# Altium project USV_drive_PCB_Project.PrjPcb
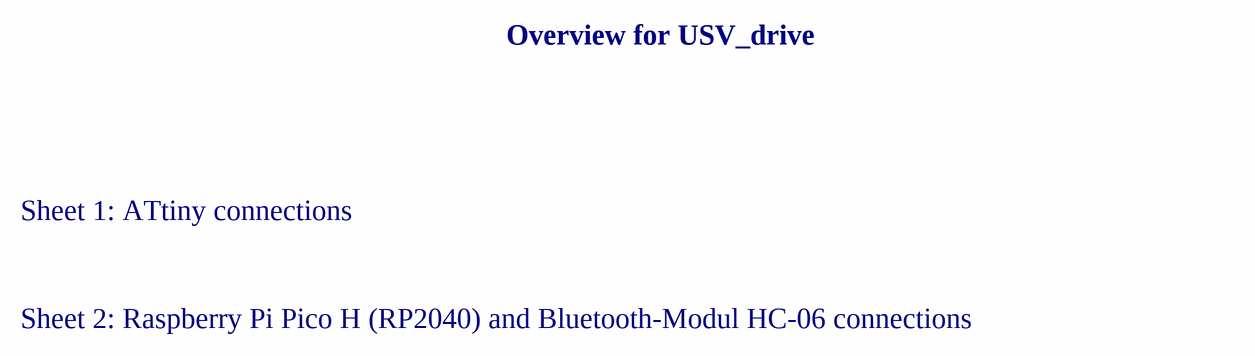
[diagram p0: Overview.SchDoc]
3 sheets, 43 parts. Net scope: flat (ports and power ports of the same name join across sheets).
Board file: USV_drive_PCB.PcbDoc
Sheets:
  Overview.SchDoc
  ATtiny_Connections.SchDoc
  Connectors.SchDoc

## Sheet Overview.SchDoc: Overview_USV_drive
size A4; Organization: Ernst-Abbe-Hochschule Jena; Address1: FB Maschinenbau; Address2: Carl-Zeiss-Promenade 2; Address3: 07745 Jena; Address4: Germany; DocumentNumber: 1; SheetNumber: 1; SheetTotal: 3

### Notes on the sheet
- Overview for USV_drive
- Sheet 1: ATtiny connections
- Sheet 2: Raspberry Pi Pico H (RP2040) and Bluetooth-Modul HC-06 connections
- Title
- Size:
- Date:
- A4
- Number:
- Time:
- Revision:
- Sheet
- of
- File:

## Sheet ATtiny_Connections.SchDoc: ATiny_connections
size A4; Organization: Ernst-Abbe-Hochschule Jena; Address1: FB Maschinenbau; Address2: Carl-Zeiss-Promenade 2; Address3: 07745 Jena; Address4: Germany; DocumentNumber: 2; SheetNumber: 2; SheetTotal: 3; SPICEModelCacheYXNNQHYV: <root> / <DocumentId>YXNNQHYV</DocumentId> / </root>
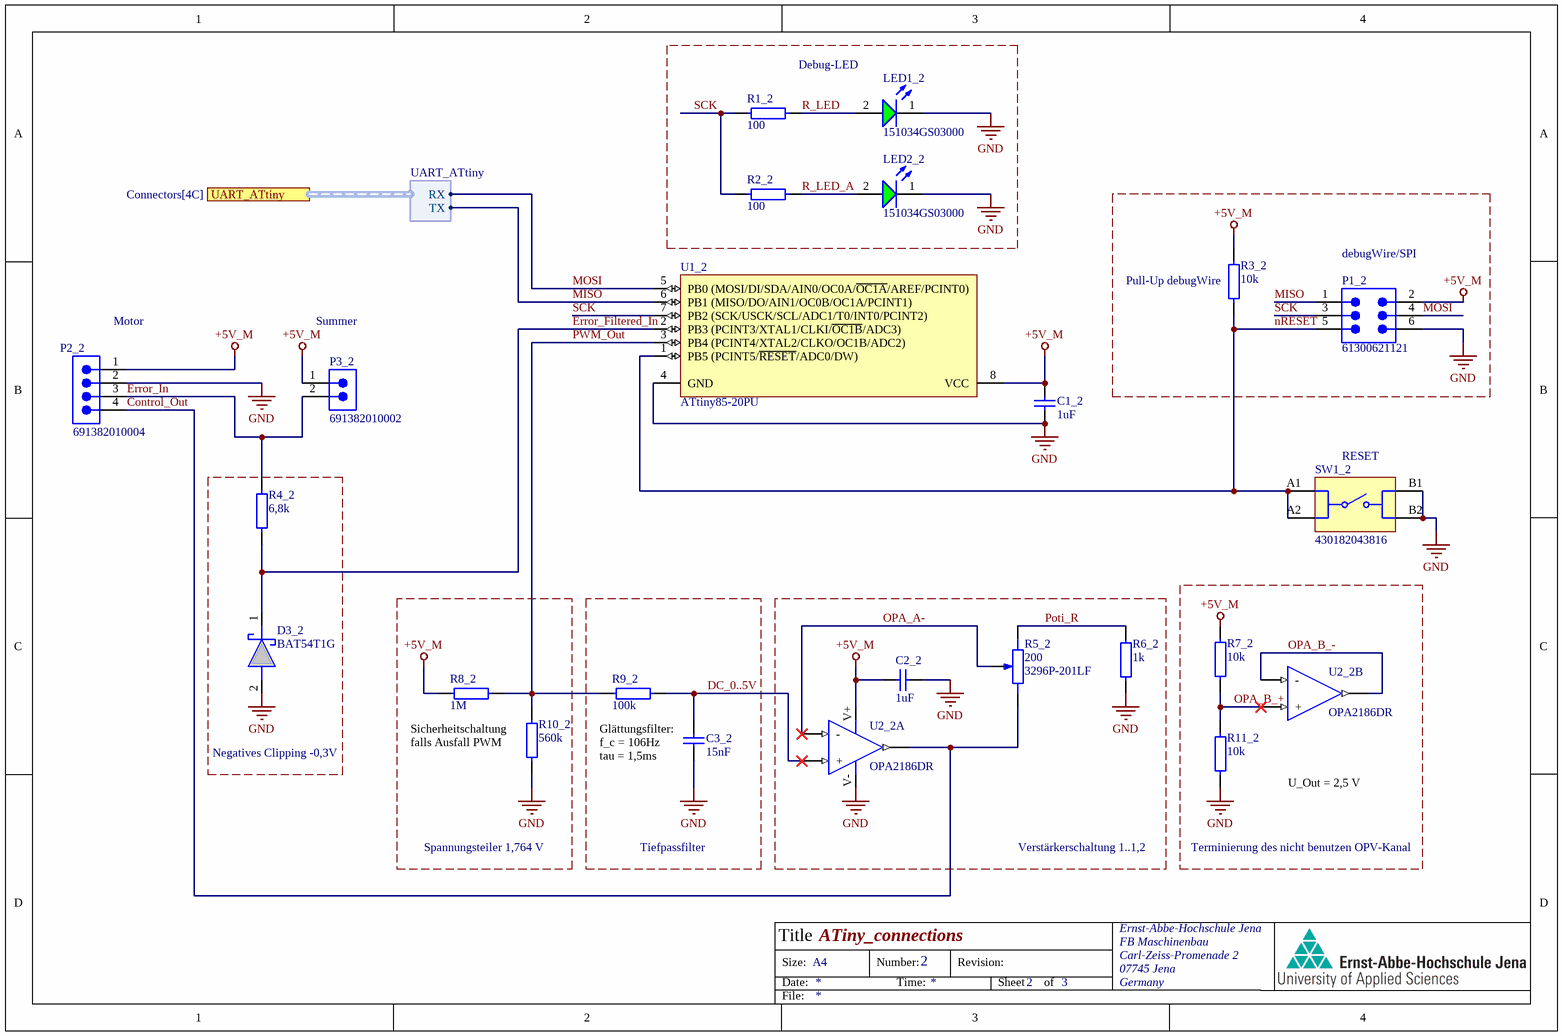
[diagram p1: ATtiny_Connections.SchDoc]

### Parts
C1_2  1uF  [SMD-0805]
C2_2  1uF  [SMD-0805]
C3_2  15nF  [SMD-0805]
D3_2  BAT54T1G  [SOD3716X135N]
LED1_2  Green, 3.2V, 30°  [WL-TMRW_D3.9H5.3]  (value not drawn)
LED2_2  Green, 3.2V, 30°  [WL-TMRW_D3.9H5.3]  (value not drawn)
P1_2  61300621121  [61300621121]
P2_2  691382010004  [691382010004]
P3_2  691382010002  [691382010002]
R1_2  100  [R-SMD-0805]
R2_2  100  [R-SMD-0805]
R3_2  10k  [R-SMD-0805]
R4_2  6,8k  [R-SMD-0805]
R5_2  200  Manufacturer Part Nr.: 3296P-201LF  [3296P-1-201LF]
R6_2  1k  [R-SMD-0805]
R7_2  10k  [R-SMD-0805]
R8_2  1M  [R-SMD-0805]
R9_2  100k  [R-SMD-0805]
R10_2  560k  [R-SMD-0805]
R11_2  10k  [R-SMD-0805]
SW1_2  430182043816  [430182043816]
U1_2  ATtiny85-20PU  [8P3]
U2_2  OPA2186DR  [SOIC127P600-8BM]  (parts A,B of 2)

### Blocks framed on the sheet
Debug-LED: LED1_2 LED2_2 R1_2 R2_2
Negatives Clipping -0,3V: D3_2 R4_2
Spannungsteiler 1,764 V: R8_2 R10_2
Tiefpassfilter: C3_2 R9_2
Verstärkerschaltung 1..1,2: C2_2 R5_2 R6_2 U2_2
Terminierung des nicht benutzen OPV-Kanal: R7_2 R11_2 U2_2

### Ports
UART_ATtiny (harness UART_ATtiny, see Connectors[4C])

### Harnesses
UART_ATtiny: RX, TX

### Nets
+5V_M: C1_2.2 C2_2.2 P1_2.2 P2_2.1 P3_2.1 R3_2.2 R7_2.2 R8_2.1 U1_2.8(VCC) U2_2.V+
GND: C1_2.1 C2_2.1 C3_2.1 D3_2.2(A) LED1_2.1(K) LED2_2.1(K) P1_2.6 P2_2.2 R6_2.2 R10_2.1 R11_2.1 SW1_2.B1 SW1_2.B2 U1_2.4(GND) U2_2.V-
Control_Out: P2_2.4 R5_2.1 U2_2.OUTA(OUT)
DC_0..5V: C3_2.2 R9_2.2 U2_2.IPA(+)
Error_Filtered_In: D3_2.1(K) R4_2.1 U1_2.2(PB3_(PCINT3/XTAL1/CLKI/~{OC1B}/ADC3))
Error_In: P2_2.3 P3_2.2 R4_2.2
MISO: P1_2.1 U1_2.6(PB1_(MISO/DO/AIN1/OC0B/OC1A/PCINT1)) ; port UART_ATtiny.TX
MOSI: P1_2.4 U1_2.5(PB0_(MOSI/DI/SDA/AIN0/OC0A/~{OC1A}/AREF/PCINT0)) ; port UART_ATtiny.RX
nRESET: P1_2.5 R3_2.1 SW1_2.A1 SW1_2.A2 U1_2.1(PB5_(PCINT5/~{RESET}/ADC0/DW))
OPA_A-: R5_2.2(TAP) U2_2.INA(-)
OPA_B_+: R7_2.1 R11_2.2 U2_2.IPB(+)
OPA_B_-: U2_2.INB(-) U2_2.OUTB(OUT)
Poti_R: R5_2.3 R6_2.1
PWM_Out: R8_2.2 R9_2.1 R10_2.2 U1_2.3(PB4_(PCINT4/XTAL2/CLKO/OC1B/ADC2))
R_LED: LED1_2.2(A) R1_2.2
R_LED_A: LED2_2.2(A) R2_2.2
SCK: P1_2.3 R1_2.1 R2_2.1 U1_2.7(PB2_(SCK/USCK/SCL/ADC1/T0/INT0/PCINT2))

### Notes on the sheet
- (near R3_2) Pull-Up debugWire
- (near P1_2) debugWire/SPI
- (near P2_2) Motor
- Summer
- (near SW1_2) RESET
- (near R10_2) Sicherheitschaltung falls Ausfall PWM
- (near C3_2) Glättungsfilter:
  f_c = 106Hz
  tau = 1,5ms
- U_Out = 2,5 V
- Title
- Size:
- Date:
- A4
- Number:
- Time:
- Revision:
- Sheet
- of
- File:

### Library data of the parts
C1_2 C2_2 C3_2 = C: Kondensator
  C1_2 C2_2: Value: 1uF
  C3_2: Value: 15nF
D3_2 = BAT54T1G: S Prefix for Automotive and Other Applications Requiring Unique Site and Control Change Requirements; AEC-Q101 Qualified and PPAP Capable; Low Forward Voltage 350 mV (Typ) @ IF = 10 mA; Extremely Fast Switching Speed; These Devices are Pb-Free, Halogen Free/BFR Free and are RoHS Compliant; Manufacturer_Name: onsemi; Geometry.Height: 1.35mm; Manufacturer_Part_Number: BAT54T1G; Mouser Part Number: 863-BAT54T1G; Mouser Price/Stock: https://www.mouser.co.uk/ProductDetail/onsemi/BAT54T1G?qs=vLkC5FC1VN9XK%252B%252BtdP3lYw%3D%3D; Arrow Part Number: BAT54T1G; Arrow Price/Stock: https://www.arrow.com/en/products/bat54t1g/on-semiconductor?utm_currency=USD&region=nac; Datasheet Link: https://www.onsemi.com/pub/Collateral/BAT54T1-D.PDF
LED1_2 LED2_2 = 151034GS03000: WL-TMRW Mono-color Round Waterclear, THT, D3.9 x H5.3mm, Green, 3.2V, 30°; Manufacturer: Wurth Elektronik; Chip Technology: InGaN; Dominant Wavelength: 530nm; Luminous Intensity: 10000mcd; Peak Wavelength: 525nm; Manufacturer Part Number: 151034GS03000; Category: Signal LEDs; Match Code: WL-TMRW; ComponentLink1Description: Website Link; ComponentLink1URL: https://www.we-online.com/redexpert/article/151034GS03000?ad; ComponentLink2Description: Datasheet Link; ComponentLink2URL: https://www.we-online.com/redexpert/spec/151034GS03000?ad; Mount: Through Hole; Operating Temperature Max: 85°C; Operating Temperature Min: -40°C; Packaging: Bulk; Height: 5.3mm; Diameter: 3.9mm; Emitting Color: Green; Forward Voltage: 3.2V; Viewing Angle: 30°
P1_2 = 61300621121: WR-PHD Pin Header, THT, Vertical, pitch 2.54mm, 2 Row, 6P; Manufacturer: Wurth Elektronik; Contact Resistance: 20mOhm; Rated Current: 3A; Working Voltage: 250V; Withstanding Voltage: 500V; Manufacturer Part Number: 61300621121; Category: Board-to-Board Connectors; Match Code: WR-PHD; ComponentLink1Description: Website Link; ComponentLink1URL: https://www.we-online.com/redexpert/article/61300621121?ad; ComponentLink2Description: Datasheet Link; ComponentLink2URL: https://www.we-online.com/redexpert/spec/61300621121?ad; Mount: Through Hole; Operating Temperature Max: 105°C; Operating Temperature Min: -40°C; Packaging: Bag; Gender: Pin Header; Number of Pins: 6; Number of Rows: 2; Orientation: Vertical; Pitch: 2.54mm
P2_2 = 691382010004: WR-TBL Series 382 Horizontal PCB Header, THT, pitch 2.5mm, 04p; Manufacturer: Wurth Elektronik; Modularity: No; Rated Current: 12A; System: Pluggable Connector; Working Voltage: 300V; Manufacturer Part Number: 691382010004; Category: Terminal Block; Match Code: WR-TBL; ComponentLink1Description: Website Link; ComponentLink1URL: https://www.we-online.com/redexpert/article/691382010004?ad; ComponentLink2Description: Datasheet Link; ComponentLink2URL: https://www.we-online.com/redexpert/spec/691382010004?ad; Mount: Through Hole; Min Operating Temperature: -40°C; Max Operating Temperature: 105°C; Packaging: Box; Application: Pluggable; Number of Pins: 4; Number of Rows: 1; Orientation: Horizontal; Pitch: 2.5mm
P3_2 = 691382010002: WR-TBL Series 382 Horizontal PCB Header, THT, pitch 2.5mm, 02p; Manufacturer: Wurth Elektronik; Modularity: No; Rated Current: 12A; System: Pluggable Connector; Working Voltage: 300V; Manufacturer Part Number: 691382010002; Category: Terminal Block; Match Code: WR-TBL; ComponentLink1Description: Website Link; ComponentLink1URL: https://www.we-online.com/redexpert/article/691382010002?ad; ComponentLink2Description: Datasheet Link; ComponentLink2URL: https://www.we-online.com/redexpert/spec/691382010002?ad; Mount: Through Hole; Min Operating Temperature: -40°C; Max Operating Temperature: 105°C; Packaging: Box; Application: Pluggable; Number of Pins: 2; Number of Rows: 1; Orientation: Horizontal; Pitch: 2.5mm
R1_2 R2_2 R3_2 R4_2 R6_2 R7_2 R8_2 R9_2 R10_2 R11_2 = R: Widerstand
  R1_2 R2_2: Value: 100
  R3_2 R7_2 R11_2: Value: 10k
  R4_2: Value: 6,8k
  R6_2: Value: 1k
  R8_2: Value: 1M
  R9_2: Value: 100k
  R10_2: Value: 560k
R5_2 = 3296P-1-201LF: Trimmer Potentiometers / Lead Sealed Type Multiturn Trimming Potentiometer / Resistance range: 200 Ohm / 25 Turns; PartNumber: PV36P???C01B00; Resistance Code: ***; Hinweis!: PartNumber muss beim Plazieren auf den Wiederstandswert laut Datenblatt abgeändert werden.; Turns: 25; Tol: +-10%; ComponentLink1Description: Datasheet; ComponentLink1URL: https://www.bourns.com/docs/Product-Datasheets/3296.pdf; Supplier 1: DigiKey; Supplier 2: Mouser; Supplier Part Number 2: 652-3296P-1-201LF; Supplier Part Number 1: 3296P-201LF-ND; Value: 200
SW1_2 = 430182043816: WS-TASV SMT Tact Switch, 6mm x 6mm, 160gf, SPST-NO, 12V, 50mA; Manufacturer: Wurth Elektronik; Washable: No; Manufacturer Part Number: 430182043816; Category: Tact Switch; Match Code: WS-TASV; ComponentLink1Description: Website Link; ComponentLink1URL: https://www.we-online.com/redexpert/article/430182043816?ad; ComponentLink2Description: Datasheet Link; ComponentLink2URL: https://www.we-online.com/redexpert/spec/430182043816?ad; Mount: Surface Mount; Min Operating Temperature: -40°C; Max Operating Temperature: 85°C; Packaging: Tape and Reel; Length: 6mm; Width: 6mm; Height: 4.3mm; Circuit: SPST-NO; Contact Material: Stainless Steel; Contact Plating: Silver; Operation Force: 160gf; Rated Current: 50mA; Rated Voltage (DC): 12V; Terminal Material: Copper Alloy; Terminal Plating: Silver
U1_2 = ATtiny85-20PU: 8-bit AVR Microcontroller, 20MHz, 2.7-5.5V, 8K Flash, 512 Bytes EEPROM, 512 Bytes SRAM, Industrial Grade (-40°C to 85°C), 8-Lead PDIP, Pb-Free; DatasheetVersion: revN, Apr-2011; PackageVersion: revB, Jan-2002; PackageReference: 8P3; PackageDescription: 8-Lead, 0.300" Wide Body, Plastic Dual In-Line Package (PDIP); Code_JEDEC: MS-001-BA; ComponentLink1Description: Manufacturer URL; ComponentLink1URL: http://www.atmel.com/; ComponentLink2Description: ATtiny25/45/85 Datasheet; ComponentLink2URL: http://www.atmel.com/dyn/resources/prod_documents/doc2586.pdf; ComponentLink3Description: ATtiny25/45/85 Summary; ComponentLink3URL: http://www.atmel.com/dyn/resources/prod_documents/2586S.pdf
U2_2 = OPA2186: The OPA186, OPA2186, and OPA4186 (OPAx186) / are low-power, 24-V, rail-to-rail input and output, zerodrift operational amplifiers (op amps). These op amps / feature only 10 µV of offset voltage (maximum) and / 0.04 µV/°C of offset voltage drift over temperature / (maximum).; pin to pad: INA>2 INB>6 IPA>3 IPB>5 OUTA>1 OUTB>7 V+>8 V->4; V+_Max: +12V; V-_Min: -12V; PartNumber: OPA2186DR; ComponentLink1Description: DataSheet; ComponentLink1URL: https://www.ti.com/lit/gpn/opa2186; Supplier 1: Digikey; Supplier 2: Mouser; Supplier Part Number 1: 296-OPA2186DRCT-ND; Supplier Part Number 2: 595-OPA2186DR

## Sheet Connectors.SchDoc: RP2040 Pico and HC-06 connections
size A4; Organization: Ernst-Abbe-Hochschule Jena; Address1: FB Maschinenbau; Address2: Carl-Zeiss-Promenade 2; Address3: 07745 Jena; Address4: Germany; DocumentNumber: 3; SheetNumber: 3; SheetTotal: 3
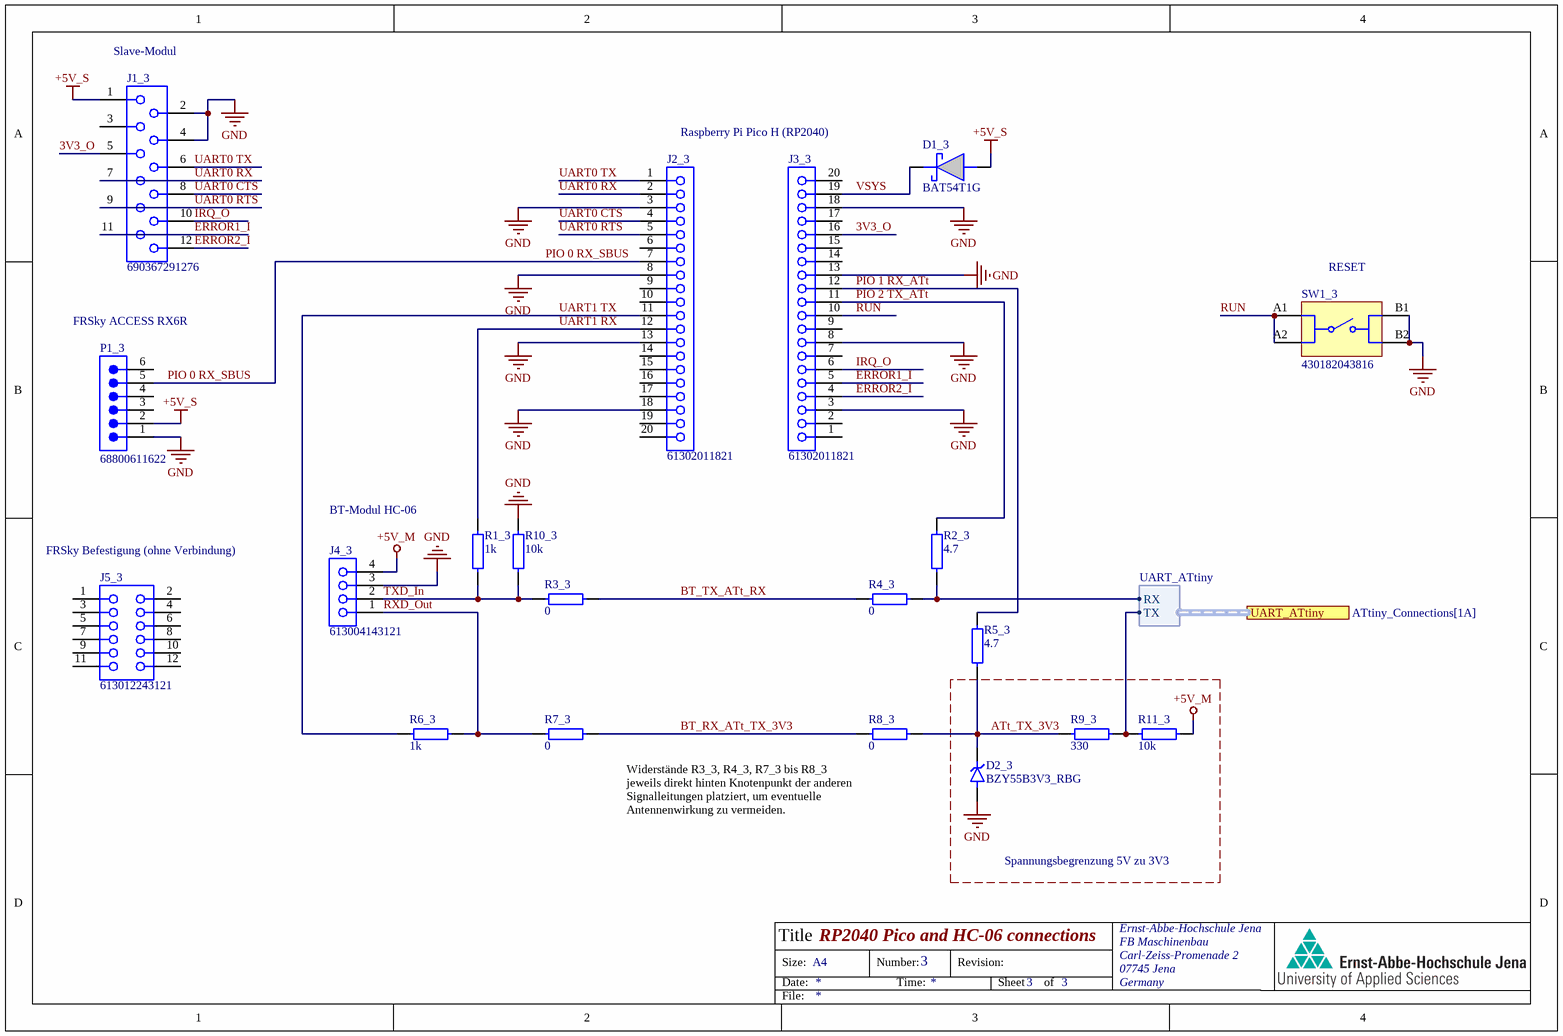
[diagram p2: Connectors.SchDoc]

### Parts
D1_3  BAT54T1G  [SOD3716X135N]
D2_3  BZY55B3V3_RBG  [DIO_BZY55B3V3_RBG]
J1_3  690367291276  [690367291276]
J2_3  61302011821  [61302011821]
J3_3  61302011821  [61302011821]
J4_3  613004143121  [613004143121]
J5_3  613012243121  [613012243121]
P1_3  68800611622  [68800611622]
R1_3  1k  [R-SMD-0805]
R2_3  4.7  [R-SMD-0805]
R3_3  0  [R-SMD-0805]
R4_3  0  [R-SMD-0805]
R5_3  4.7  [R-SMD-0805]
R6_3  1k  [R-SMD-0805]
R7_3  0  [R-SMD-0805]
R8_3  0  [R-SMD-0805]
R9_3  330  [R-SMD-0805]
R10_3  10k  [R-SMD-0805]
R11_3  10k  [R-SMD-0805]
SW1_3  430182043816  [430182043816]

### Blocks framed on the sheet
Spannungsbegrenzung 5V zu 3V3: D2_3 R9_3 R11_3

### Ports
UART_ATtiny (harness UART_ATtiny, see ATtiny_Connections[1A])

### Harnesses
UART_ATtiny: RX, TX

### Nets
+5V_M: J4_3.4 R11_3.1
+5V_S: D1_3.2(A) J1_3.1 P1_3.2
GND: D2_3.A J1_3.2 J1_3.4 J2_3.3 J2_3.8 J2_3.13 J2_3.18 J3_3.3 J3_3.8 J3_3.13 J3_3.18 J4_3.3 P1_3.1 R10_3.2 SW1_3.B1 SW1_3.B2
3V3_O: J1_3.5 J3_3.16
ATt_TX_3V3: D2_3.C(K) R5_3.1 R8_3.2 R9_3.2
BT_RX_ATt_TX_3V3: R7_3.2 R8_3.1
BT_TX_ATt_RX: R3_3.2 R4_3.1
ERROR1_I: J1_3.11 J3_3.5
ERROR2_I: J1_3.12 J3_3.4
IRQ_O: J1_3.10 J3_3.6
MISO: R9_3.1 R11_3.2 ; port UART_ATtiny.TX
MOSI: R2_3.1 R4_3.2 ; port UART_ATtiny.RX
PIO 0 RX_SBUS: J2_3.7 P1_3.5
PIO 1 RX_ATt: J3_3.12 R5_3.2
PIO 2 TX_ATt: J3_3.11 R2_3.2
RUN: J3_3.10 SW1_3.A1 SW1_3.A2
RXD_Out: J4_3.1 R6_3.2 R7_3.1
TXD_In: J4_3.2 R1_3.1 R3_3.1 R10_3.1
UART0 CTS: J1_3.8 J2_3.4
UART0 RTS: J1_3.9 J2_3.5
UART0 RX: J1_3.7 J2_3.2
UART0 TX: J1_3.6 J2_3.1
UART1 RX: J2_3.12 R1_3.2
UART1 TX: J2_3.11 R6_3.1
VSYS: D1_3.1(K) J3_3.19

Not connected (* = marked no-connect by the designer): J1_3 3; J2_3 6 9 10 14 15 16 17 19 20; J3_3 1 2 7 9 14 15 17 20; J5_3 1 2 3 4 5 6 7 8 9 10 11 12; P1_3 3 4 6

### Notes on the sheet
- (near J1_3) Slave-Modul
- Raspberry Pi Pico H (RP2040)
- (near SW1_3) RESET
- (near P1_3) FRSky ACCESS RX6R
- BT-Modul HC-06
- (near J5_3) FRSky Befestigung (ohne Verbindung)
- Widerstände R3_3, R4_3, R7_3 bis R8_3 jeweils direkt hinten Knotenpunkt der anderen Signalleitungen platziert, um eventuelle Antennenwirkung zu vermeiden.
- Title
- Size:
- Date:
- A4
- Number:
- Time:
- Revision:
- Sheet
- of
- File:

### Library data of the parts
D1_3 = BAT54T1G: as D3_2 on sheet ATtiny_Connections; Manufacturer_Part_Number: BAT54T1G; Mouser Part Number: 863-BAT54T1G; Mouser Price/Stock: https://www.mouser.co.uk/ProductDetail/onsemi/BAT54T1G?qs=vLkC5FC1VN9XK%252B%252BtdP3lYw%3D%3D; Arrow Part Number: BAT54T1G; Arrow Price/Stock: https://www.arrow.com/en/products/bat54t1g/on-semiconductor?utm_currency=USD&region=nac; Datasheet Link: https://www.onsemi.com/pub/Collateral/BAT54T1-D.PDF
J1_3 = 690367291276: WR-MM Mini Module Connector, Female, SMT, with Latch & Polarization, Straight, pitch 2.54mm, 12p; Manufacturer: Wurth Elektronik; Contact Resistance: 10mΩ; Insulation Resistance: 1000MΩ; Rated Current: 1.5A; Working Voltage: 250VAC; Withstanding Voltage: 500VAC; ComponentLink1Description: Website Link; ComponentLink1URL: https://www.we-online.com/redexpert/article/690367291276?ad; ComponentLink2Description: Datasheet Link; ComponentLink2URL: https://www.we-online.com/redexpert/spec/690367291276?ad; Manufacturer Part Number: 690367291276; Category: Board-to-Board Connectors; Match Code: WR-MM; Mount: Surface Mount; Operating Temperature Max: 105°C; Operating Temperature Min: -40°C; Packaging: Tape and Reel; Length: 19.84mm; Gender: Female; Number of Pins: 12; Orientation: Straight; Pitch: 2.54mm
J2_3 J3_3 = 61302011821: WR-PHD Socket Header, THT, Vertical, pitch 2.54mm, 1 Row, 20P; Manufacturer: Wurth Elektronik; Contact Resistance: 20mOhm; Rated Current: 3A; Working Voltage: 250V; Withstanding Voltage: 500V; Manufacturer Part Number: 61302011821; Category: Board-to-Board Connectors; Match Code: WR-PHD; ComponentLink1Description: Website Link; ComponentLink1URL: https://www.we-online.com/redexpert/article/61302011821?ad; ComponentLink2Description: Datasheet Link; ComponentLink2URL: https://www.we-online.com/redexpert/spec/61302011821?ad; Mount: Through Hole; Operating Temperature Max: 105°C; Operating Temperature Min: -40°C; Packaging: Tray; Gender: Socket Header; Number of Pins: 20; Number of Rows: 1; Orientation: Vertical; Pitch: 2.54mm
  J3_3: ClassName: RPI_Pico
J4_3 = 613004143121: WR-PHD Socket Header, THT, Angled, pitch 2.54mm, 1 Row, 4P; Manufacturer: Wurth Elektronik; Contact Resistance: 20mOhm; Rated Current: 3A; Working Voltage: 250V; Withstanding Voltage: 500V; Manufacturer Part Number: 613004143121; Category: Board-to-Board Connectors; Match Code: WR-PHD; ComponentLink1Description: Website Link; ComponentLink1URL: https://www.we-online.com/redexpert/article/613004143121?ad; ComponentLink2Description: Datasheet Link; ComponentLink2URL: https://www.we-online.com/redexpert/spec/613004143121?ad; Mount: Through Hole; Operating Temperature Max: 125°C; Operating Temperature Min: -40°C; Packaging: Tray; Gender: Socket Header; Number of Pins: 4; Number of Rows: 1; Orientation: Angled; Pitch: 2.54mm
J5_3 = 613012243121: WR-PHD Socket Header, THT, Angled, pitch 2.54mm, 2 Row, 12P; Manufacturer: Wurth Elektronik; Contact Resistance: 20mOhm; Rated Current: 3A; Working Voltage: 250V; Withstanding Voltage: 500V; Manufacturer Part Number: 613012243121; Category: Board-to-Board Connectors; Match Code: WR-PHD; ComponentLink1Description: Website Link; ComponentLink1URL: https://www.we-online.com/redexpert/article/613012243121?ad; ComponentLink2Description: Datasheet Link; ComponentLink2URL: https://www.we-online.com/redexpert/spec/613012243121?ad; Mount: Through Hole; Operating Temperature Max: 125°C; Operating Temperature Min: -40°C; Packaging: Tray; Gender: Socket Header; Number of Pins: 12; Number of Rows: 2; Orientation: Angled; Pitch: 2.54mm
P1_3 = 68800611622: WR-WTB “J” Type THT Vertical Male Shrouded Header, pitch 2.5 mm, 6 pins; Manufacturer: Wurth Elektronik; Pitch: 2.5 mm; Rated Current: 3 A; Working Voltage: 250 V(AC); Contact Resistance: 20 mΩ; Withstanding Voltage: 800 V(AC); Manufacturer Part Number: 68800611622; Category: Wire-to-Board Connector; Match Code: WR-WTB; ComponentLink1Description: Website Link; ComponentLink1URL: https://www.we-online.com/redexpert/article/68800611622?ad; ComponentLink2Description: Datasheet Link; ComponentLink2URL: https://www.we-online.com/redexpert/spec/68800611622?ad; Mount: Through Hole; Min Operating Temperature: -25 °C; Max Operating Temperature: 85 °C; Packaging: Bag; Number of Pins: 6; Number of Rows: 1; Orientation: Vertical; Length: 17.5 mm; Width: 3.8 mm; Height: 6 mm; Gender: Male
R1_3 R2_3 R3_3 R4_3 R5_3 R6_3 R7_3 R8_3 R9_3 R10_3 R11_3 = R: Widerstand
  R1_3 R6_3: Value: 1k
  R2_3 R5_3: Value: 4.7
  R3_3 R4_3 R7_3 R8_3: Value: 0
  R9_3: Value: 330
  R10_3 R11_3: Value: 10k
SW1_3 = 430182043816: as SW1_2 on sheet ATtiny_Connections; Manufacturer Part Number: 430182043816; Category: Tact Switch; Match Code: WS-TASV; ComponentLink1Description: Website Link; ComponentLink1URL: https://www.we-online.com/redexpert/article/430182043816?ad; ComponentLink2Description: Datasheet Link; ComponentLink2URL: https://www.we-online.com/redexpert/spec/430182043816?ad; Mount: Surface Mount; Min Operating Temperature: -40°C; Max Operating Temperature: 85°C; Packaging: Tape and Reel; Length: 6mm; Width: 6mm; Height: 4.3mm; Circuit: SPST-NO; Contact Material: Stainless Steel; Contact Plating: Silver; Operation Force: 160gf; Rated Current: 50mA; Rated Voltage (DC): 12V; Terminal Material: Copper Alloy; Terminal Plating: Silver
D2_3 = BZY55B3V3_RBG: Price: None; Package: None; Availability: Unavailable; Value: *; MP: BZY55B3V3_RBG

## Nets that join several sheets
+5V_M: ATtiny_Connections (10 pins), Connectors (J4_3.4 R11_3.1)
GND: ATtiny_Connections (15 pins), Connectors (16 pins)
MISO: ATtiny_Connections (P1_2.1 U1_2.6), Connectors (R9_3.1 R11_3.2)
MOSI: ATtiny_Connections (P1_2.4 U1_2.5), Connectors (R2_3.1 R4_3.2)

## Assembly variants
PCB_Port: not fitted R3_3 R4_3 R7_3 R8_3
PCB_Starboard: not fitted D1_3 J1_3 J2_3 J3_3 J5_3 P1_3 R1_3 R2_3 R5_3 R6_3 R? SW1_3